# Altium schematic sheet LaunchPad Mini.SchDoc
size A4
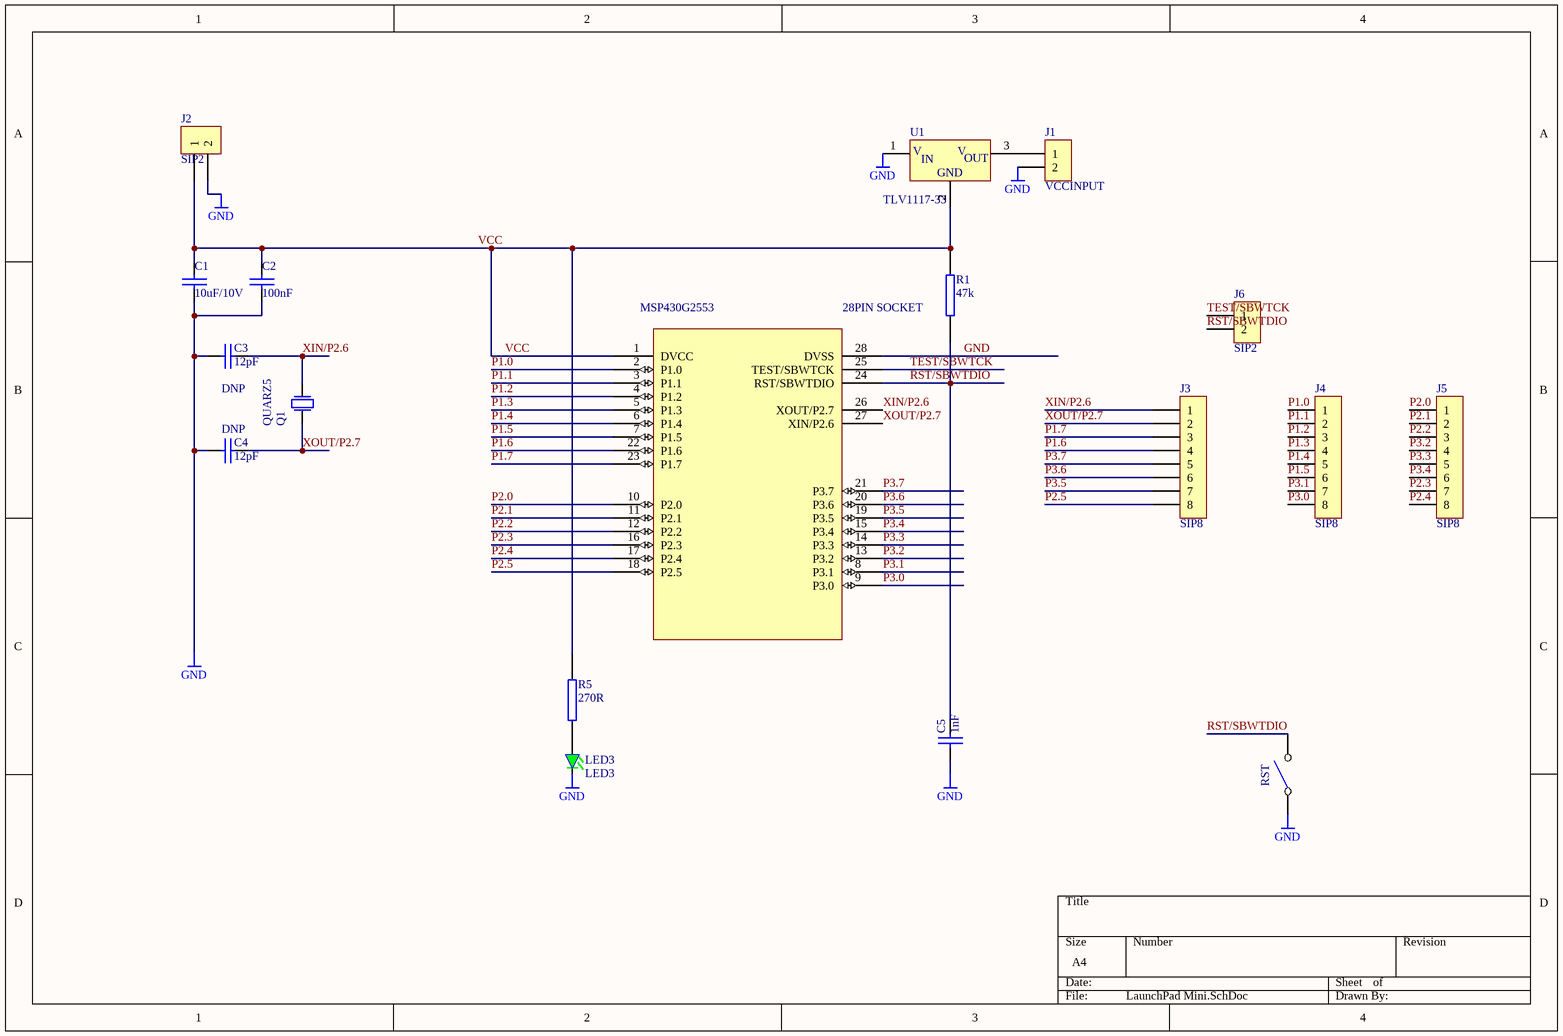
[diagram p0: LaunchPad Mini.SchDoc]

## Parts
C1  10uF/10V  [CR2012-0805]
C2  100nF  [CR1608-0603]
C3  12pF  [CR1608-0603]
C4  12pF  [CR1608-0603]
C5  1nF  [CR1608-0603]
J1  VCCINPUT  [SIP2-2.54]
J2  SIP2  [SIP2-2.54]
J3  SIP8  [SIP8-2.54]
J4  SIP8  [SIP8-2.54]
J5  SIP8  [SIP8-2.54]
J6  SIP2  [SIP2-2.54]
LED3  LED3  [CR1608-0603]
MSP430G2553  28PIN SOCKET  [TSSOP-28]
Q1  QUARZ5  [CR1608-0603]
R1  47k  [CR1608-0603]
R5  270R  [CR1608-0603]
RST  (no value)  [PCBComponent_1]
U1  TLV1117-33  [SOT-223]

## Nets
GND: C1.1 C2.1 C3.1 C4.1 C5.2 J1.2 J2.2 LED3.K(k) MSP430G2553.28(DVSS) RST.1(COMMON) U1.1(VIN)
P1.0: J4.1 MSP430G2553.2(P1.0)
P1.1: J4.2 MSP430G2553.3(P1.1)
P1.2: J4.3 MSP430G2553.4(P1.2)
P1.3: J4.4 MSP430G2553.5(P1.3)
P1.4: J4.5 MSP430G2553.6(P1.4)
P1.5: J4.6 MSP430G2553.7(P1.5)
P1.6: J3.4 MSP430G2553.22(P1.6)
P1.7: J3.3 MSP430G2553.23(P1.7)
P2.0: J5.1 MSP430G2553.10(P2.0)
P2.1: J5.2 MSP430G2553.11(P2.1)
P2.2: J5.3 MSP430G2553.12(P2.2)
P2.3: J5.7 MSP430G2553.16(P2.3)
P2.4: J5.8 MSP430G2553.17(P2.4)
P2.5: J3.8 MSP430G2553.18(P2.5)
P3.0: J4.8 MSP430G2553.9(P3.0)
P3.1: J4.7 MSP430G2553.8(P3.1)
P3.2: J5.4 MSP430G2553.13(P3.2)
P3.3: J5.5 MSP430G2553.14(P3.3)
P3.4: J5.6 MSP430G2553.15(P3.4)
P3.5: J3.7 MSP430G2553.19(P3.5)
P3.6: J3.6 MSP430G2553.20(P3.6)
P3.7: J3.5 MSP430G2553.21(P3.7)
RST/SBWTDIO: C5.1 J6.2 MSP430G2553.24(RST/SBWTDIO) R1.1 RST.2(NO)
TEST/SBWTCK: J6.1 MSP430G2553.25(TEST/SBWTCK)
VCC: C1.2 C2.2 J2.1 MSP430G2553.1(DVCC) R1.2 R5.1 U1.2(GND)
XIN/P2.6: C3.2 J3.1 MSP430G2553.26(XOUT/P2.7) Q1.2(P2)
XOUT/P2.7: C4.2 J3.2 MSP430G2553.27(XIN/P2.6) Q1.1(P1)
NetJ1_1: J1.1 U1.3(VOUT)
NetLED3_A: LED3.A(a) R5.2

## Notes on the sheet
- (near C3) DNP
- (near C4) DNP
- (in symbol 78L05) V; IN; OUT

## Library data of the parts
C1-C5 = CAP: Capacitor
J1 J2 J6 = SIP2: jointbar
J3-J5 = SIP8: jointbar
LED3 = LED: pin to pad: A>1 K>2
MSP430G2553 = ATMEGA8_DIP28: Atmel Microcontroller - Library created by carel..  <www.mpfreezone.com>
Q1 = QUARZ5: Crystal Oscillator
R1 R5 = RES2
RST = SW SPST
U1 = 78L05: 3-Terminal Positive Voltage Regulator